# Altium project DBG-010.PrjPcb
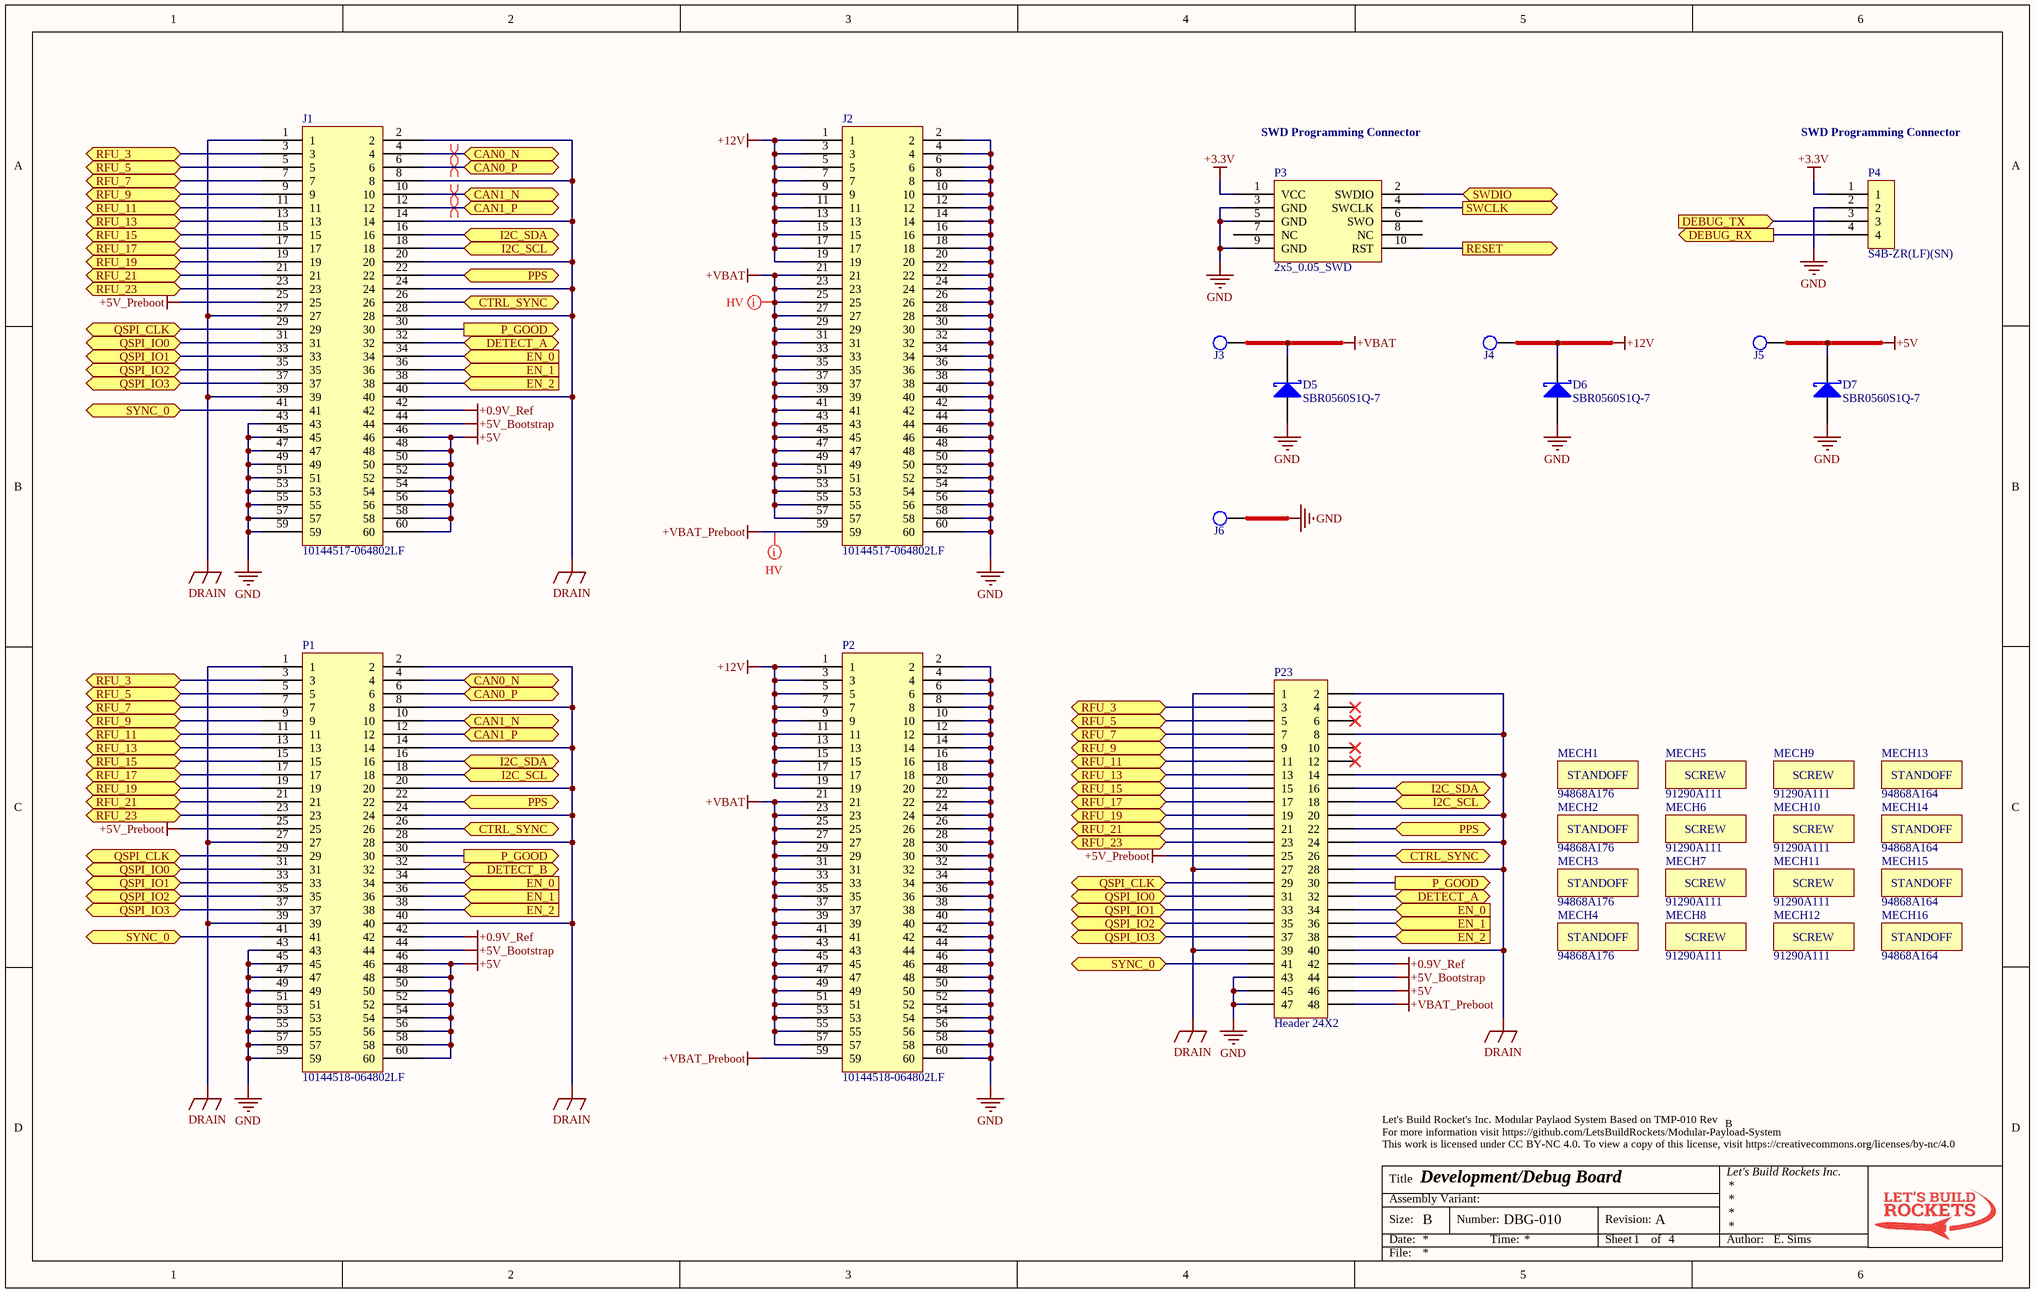
[diagram p0: Sheet1.SchDoc]
ProjectAuthor: E. Sims; ProjectDocumentNumber: DBG-010; ProjectOrganization: Let's Build Rockets Inc.; ProjectRevision: A; ProjectTitle: Development/Debug Board; TemplateRevision: B
4 sheets, 111 parts. Net scope: flat (ports and power ports of the same name join across sheets).
Board file: DBG-010.PcbDoc
Sheets:
  Sheet1.SchDoc
  Sheet2.SchDoc
  Sheet3.SchDoc
  Sheet4.SchDoc

## Sheet Sheet1.SchDoc
size B; SheetNumber: 1; SheetTotal: 4

### Parts
D5  SBR0560S1Q-7  [SOD123]
D6  SBR0560S1Q-7  [SOD123]
D7  SBR0560S1Q-7  [SOD123]
J1  10144517-064802LF  [10144517-064802LF]
J2  10144517-064802LF  [10144517-064802LF]
J3  Banana  [CT3151SP-2]  (value not drawn)
J4  Banana  [CT3151SP-2]  (value not drawn)
J5  Banana  [CT3151SP-2]  (value not drawn)
J6  Banana  [CT3151SP-0]  (value not drawn)
MECH1  94868A176  [94868A176]
MECH2  94868A176  [94868A176]
MECH3  94868A176  [94868A176]
MECH4  94868A176  [94868A176]
MECH5  91290A111  [91290A111]
MECH6  91290A111  [91290A111]
MECH7  91290A111  [91290A111]
MECH8  91290A111  [91290A111]
MECH9  91290A111  [91290A111]
MECH10  91290A111  [91290A111]
MECH11  91290A111  [91290A111]
MECH12  91290A111  [91290A111]
MECH13  94868A164  [94868A164]
MECH14  94868A164  [94868A164]
MECH15  94868A164  [94868A164]
MECH16  94868A164  [94868A164]
P1  10144518-064802LF  [10144518-064802LF]
P2  10144518-064802LF  [10144518-064802LF]
P3  2x5_0.05_SWD  [2x5_0.05_R]
P4  S4B-ZR(LF)(SN)  [S4B-ZR(LF)(SN)]
P23  Header 24X2  [HDR2X24]  (no BOM)

### Ports
CAN0_N (bidir), CAN0_P (bidir), CAN1_N (bidir), CAN1_P (bidir), CTRL_SYNC (bidir), DEBUG_RX (out), DEBUG_TX (in), DETECT_A (bidir), DETECT_B (bidir), EN_0 (in), EN_1 (in), EN_2 (in), I2C_SCL (bidir), I2C_SDA (bidir), P_GOOD (out), PPS (bidir), QSPI_CLK (bidir), QSPI_IO0 (bidir), QSPI_IO1 (bidir), QSPI_IO2 (bidir), QSPI_IO3 (bidir), RESET (out), RFU_3 (bidir), RFU_5 (bidir), RFU_7 (bidir), RFU_9 (bidir), RFU_11 (bidir), RFU_13 (bidir), RFU_15 (bidir), RFU_17 (bidir), RFU_19 (bidir), RFU_21 (bidir), RFU_23 (bidir), SWCLK (out), SWDIO (bidir), SYNC_0 (bidir)

### Nets
+0.9V_Ref: J1.42 P1.42 P23.42
+3.3V: P3.1(VCC) P4.1
+5V: D7.K J1.46 J1.48 J1.50 J1.52 J1.54 J1.56 J1.58 J1.60 J5.1 P1.46 P1.48 P1.50 P1.52 P1.54 P1.56 P1.58 P1.60 P23.46
+5V_Bootstrap: J1.44 P1.44 P23.44
+5V_Preboot: J1.25 P1.25 P23.25
+12V: D6.K J2.1 J2.3 J2.5 J2.7 J2.9 J2.11 J2.13 J2.15 J2.17 J2.19 J4.1 P2.1 P2.3 P2.5 P2.7 P2.9 P2.11 P2.13 P2.15 P2.17 P2.19
+VBAT: D5.K J2.21 J2.23 J2.25 J2.27 J2.29 J2.31 J2.33 J2.35 J2.37 J2.39 J2.41 J2.43 J2.45 J2.47 J2.49 J2.51 J2.53 J2.55 J2.57 J3.1 P2.21 P2.23 P2.25 P2.27 P2.29 P2.31 P2.33 P2.35 P2.37 P2.39 P2.41 P2.43 P2.45 P2.47 P2.49 P2.51 P2.53 P2.55 P2.57
+VBAT_Preboot: J2.59 P2.59 P23.48
DRAIN: J1.1 J1.2 J1.8 J1.14 J1.20 J1.24 J1.27 J1.28 J1.39 J1.40 P1.1 P1.2 P1.8 P1.14 P1.20 P1.24 P1.27 P1.28 P1.39 P1.40 P23.1 P23.2 P23.8 P23.14 P23.20 P23.24 P23.27 P23.28 P23.39 P23.40
GND: D5.A D6.A D7.A J1.43 J1.45 J1.47 J1.49 J1.51 J1.53 J1.55 J1.57 J1.59 J2.2 J2.4 J2.6 J2.8 J2.10 J2.12 J2.14 J2.16 J2.18 J2.20 J2.22 J2.24 J2.26 J2.28 J2.30 J2.32 J2.34 J2.36 J2.38 J2.40 J2.42 J2.44 J2.46 J2.48 J2.50 J2.52 J2.54 J2.56 J2.58 J2.60 J6.1 P1.43 P1.45 P1.47 P1.49 P1.51 P1.53 P1.55 P1.57 P1.59 P2.2 P2.4 P2.6 P2.8 P2.10 P2.12 P2.14 P2.16 P2.18 P2.20 P2.22 P2.24 P2.26 P2.28 P2.30 P2.32 P2.34 P2.36 P2.38 P2.40 P2.42 P2.44 P2.46 P2.48 P2.50 P2.52 P2.54 P2.56 P2.58 P2.60 P3.3(GND) P3.5(GND) P3.9(GND) P4.2 P23.43 P23.45 P23.47
CAN0_N: J1.4 P1.4 ; port CAN0_N
CAN0_P: J1.6 P1.6 ; port CAN0_P
CAN1_N: J1.10 P1.10 ; port CAN1_N
CAN1_P: J1.12 P1.12 ; port CAN1_P
CTRL_SYNC: J1.26 P1.26 P23.26 ; port CTRL_SYNC
DEBUG_RX: P4.4 ; port DEBUG_RX
DEBUG_TX: P4.3 ; port DEBUG_TX
DETECT_A: J1.32 P23.32 ; port DETECT_A
DETECT_B: P1.32 ; port DETECT_B
EN_0: J1.34 P1.34 P23.34 ; port EN_0
EN_1: J1.36 P1.36 P23.36 ; port EN_1
EN_2: J1.38 P1.38 P23.38 ; port EN_2
I2C_SCL: J1.18 P1.18 P23.18 ; port I2C_SCL
I2C_SDA: J1.16 P1.16 P23.16 ; port I2C_SDA
P_GOOD: J1.30 P1.30 P23.30 ; port P_GOOD
PPS: J1.22 P1.22 P23.22 ; port PPS
QSPI_CLK: J1.29 P1.29 P23.29 ; port QSPI_CLK
QSPI_IO0: J1.31 P1.31 P23.31 ; port QSPI_IO0
QSPI_IO1: J1.33 P1.33 P23.33 ; port QSPI_IO1
QSPI_IO2: J1.35 P1.35 P23.35 ; port QSPI_IO2
QSPI_IO3: J1.37 P1.37 P23.37 ; port QSPI_IO3
RESET: P3.10(RST) ; port RESET
RFU_3: J1.3 P1.3 P23.3 ; port RFU_3
RFU_5: J1.5 P1.5 P23.5 ; port RFU_5
RFU_7: J1.7 P1.7 P23.7 ; port RFU_7
RFU_9: J1.9 P1.9 P23.9 ; port RFU_9
RFU_11: J1.11 P1.11 P23.11 ; port RFU_11
RFU_13: J1.13 P1.13 P23.13 ; port RFU_13
RFU_15: J1.15 P1.15 P23.15 ; port RFU_15
RFU_17: J1.17 P1.17 P23.17 ; port RFU_17
RFU_19: J1.19 P1.19 P23.19 ; port RFU_19
RFU_21: J1.21 P1.21 P23.21 ; port RFU_21
RFU_23: J1.23 P1.23 P23.23 ; port RFU_23
SWCLK: P3.4(SWCLK) ; port SWCLK
SWDIO: P3.2(SWDIO) ; port SWDIO
SYNC_0: J1.41 P1.41 P23.41 ; port SYNC_0

Not connected (* = marked no-connect by the designer): P3 6(SWO) 7(NC) 8(NC); P23 4* 6* 10* 12*

### Layout directives
differential pair; differential pair class CAN: CAN0_N, CAN0_P, CAN1_N, CAN1_P
net class HIghVoltage: +VBAT, +VBAT_Preboot

### Notes on the sheet
- SWD Programming Connector
- Let's Build Rocket's Inc. Modular Paylaod System Based on TMP-010 Rev
  For more information visit https://github.com/LetsBuildRockets/Modular-Payload-System
  This work is licensed under CC BY-NC 4.0. To view a copy of this license, visit https://creativecommons.org/licenses/by-nc/4.0
- Title
- Size:
- Date:
- Assembly Variant:
- B
- Number:
- Time:
- Revision:
- Sheet
- of
- Author:
- File:
- (in symbol 91290A111) SCREW
- (in symbol 94868A164) STANDOFF
- (in symbol 94868A176) STANDOFF

### Library data of the parts
D5-D7 = SBR0560S1Q-7: Unit Price (USD): 0.37
J1 J2 = 10144517-064802LF: Unit Price (USD): 1.95
J3-J5 = CT3151SP-2: Unit Price (USD): 2.05
J6 = CT3151SP-0: Unit Price (USD): 2.05
MECH1-MECH4 = 94868A176: Unit Price (USD): 1.32
MECH5-MECH12 = 91290A111: Unit Price (USD): 0.0871
MECH13-MECH16 = 94868A164: Unit Price (USD): 1..10
P1 P2 = 10144518-064802LF: Unit Price (USD): 1.52
P3 = 2x5_0.05_SWD: Unit Price (USD): 0.75
P4 = S4B-ZR(LF)(SN): Unit Price (USD): 0.24
P23 = Header 24X2: Header, 24-Pin, Dual row; LatestRevisionDate: 17-Jul-2002; LatestRevisionNote: Re-released for DXP Platform.; Publisher: Altium Limited

## Sheet Sheet2.SchDoc
size B; SheetNumber: 2; SheetTotal: 4
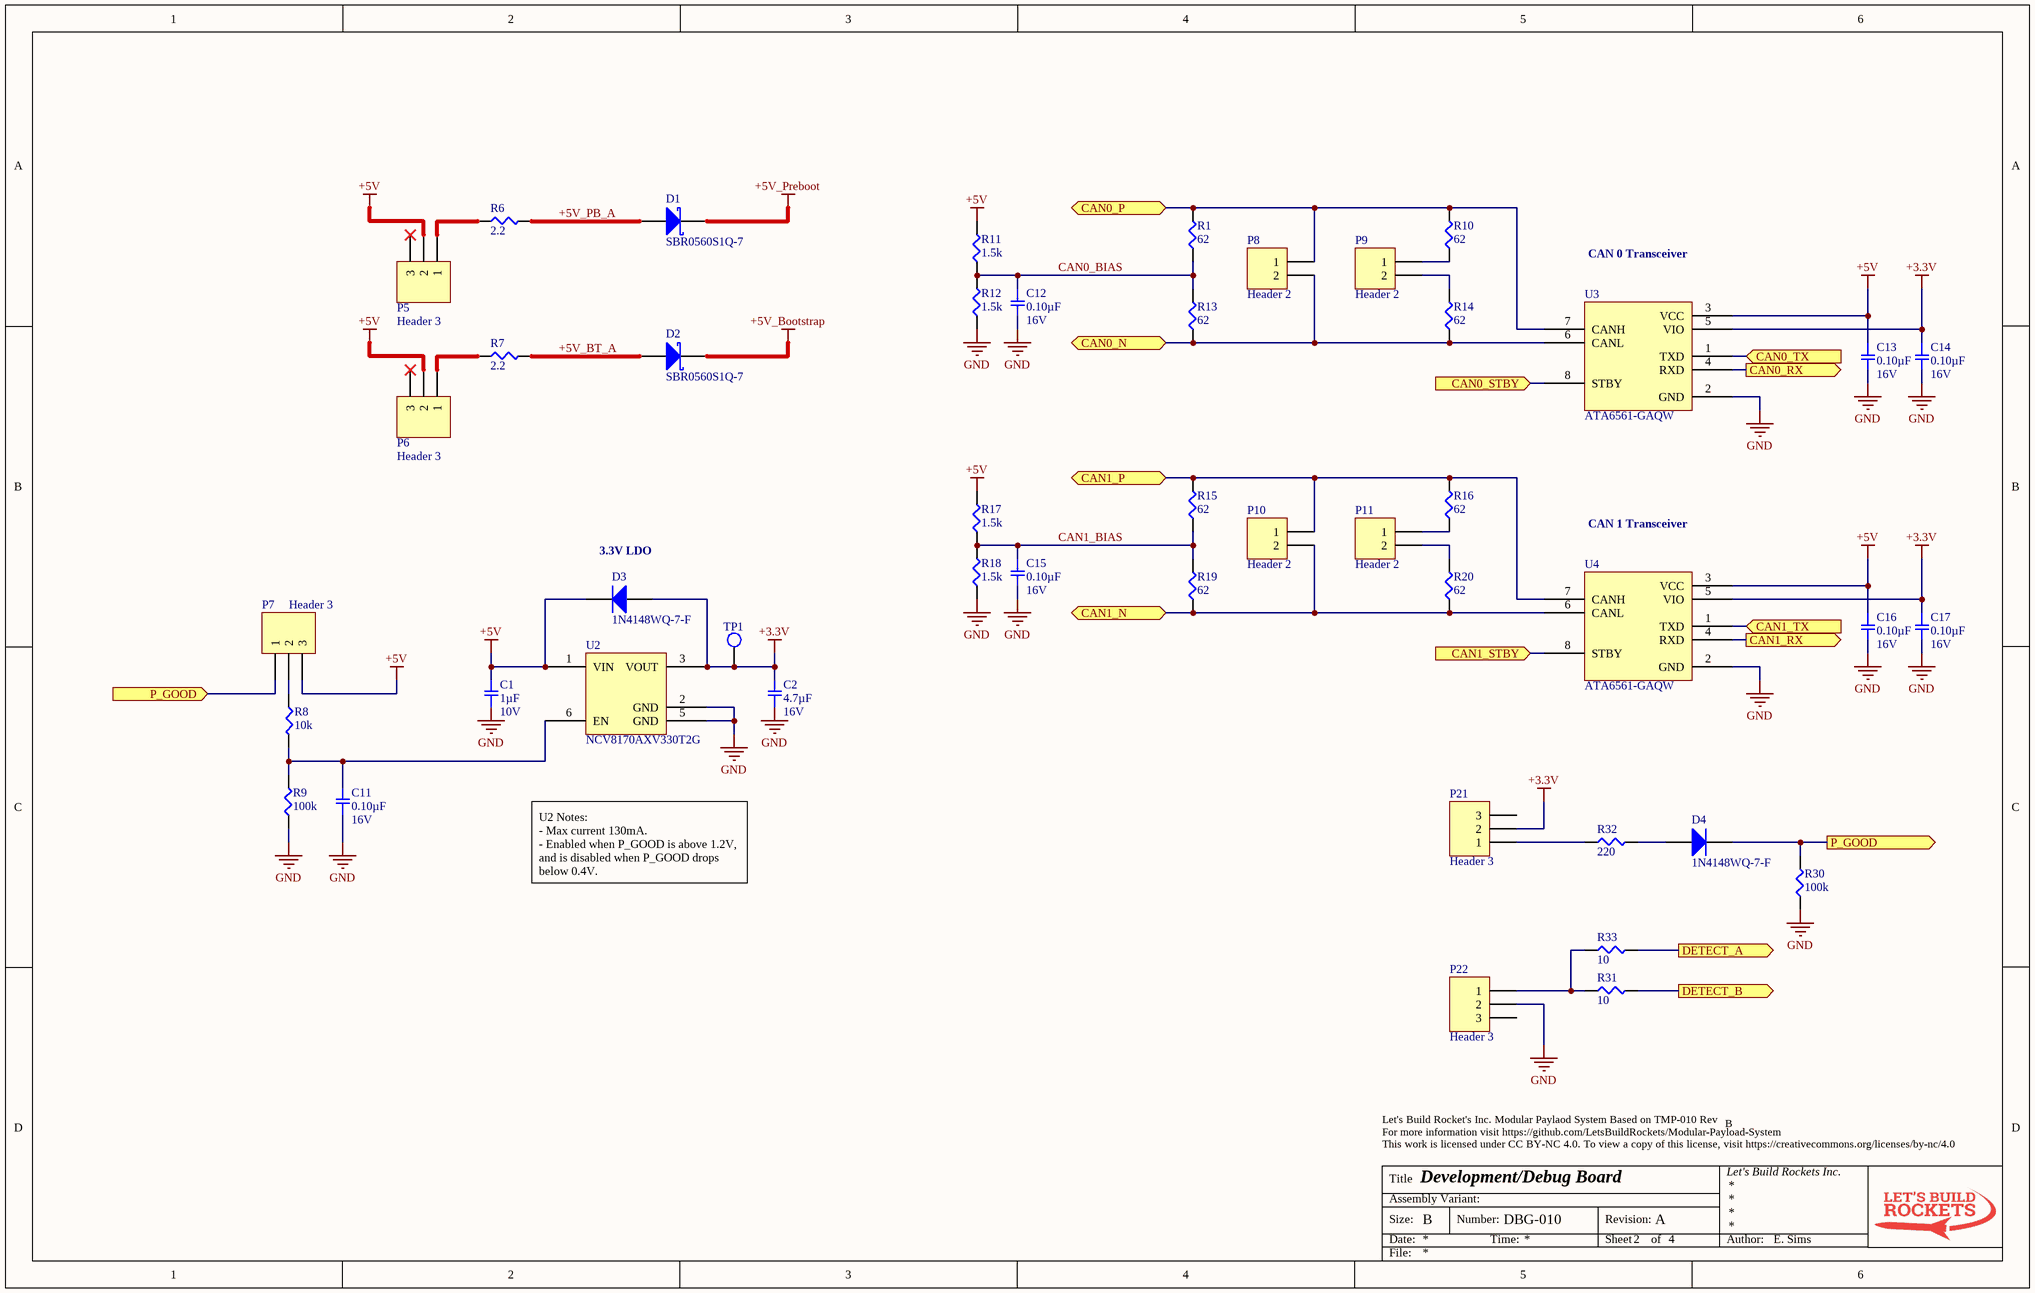
[diagram p1: Sheet2.SchDoc]

### Parts
C1  1µF  Voltage: 10V  [SMD-0402C]
C2  4.7µF  Voltage: 16V  [SMD-0805C]
C11  0.10µF  Voltage: 16V  [SMD-0402C]
C12  0.10µF  Voltage: 16V  [SMD-0402C]
C13  0.10µF  Voltage: 16V  [SMD-0402C]
C14  0.10µF  Voltage: 16V  [SMD-0402C]
C15  0.10µF  Voltage: 16V  [SMD-0402C]
C16  0.10µF  Voltage: 16V  [SMD-0402C]
C17  0.10µF  Voltage: 16V  [SMD-0402C]
D1  SBR0560S1Q-7  [SOD123]
D2  SBR0560S1Q-7  [SOD123]
D3  1N4148WQ-7-F  [SOD123]
D4  1N4148WQ-7-F  [SOD123]
P5  Header 3  [HDR1X3]  (no BOM)
P6  Header 3  [HDR1X3]  (no BOM)
P7  Header 3  [HDR1X3]  (no BOM)
P8  Header 2  [HDR1X2]  (no BOM)
P9  Header 2  [HDR1X2]  (no BOM)
P10  Header 2  [HDR1X2]  (no BOM)
P11  Header 2  [HDR1X2]  (no BOM)
P21  Header 3  [HDR1X3]  (no BOM)
P22  Header 3  [HDR1X3]  (no BOM)
R1  62  [SMD-0603-RES]
R6  2.2  [SMD-0805-RES]
R7  2.2  [SMD-0805-RES]
R8  10k  [SMD-0402-RES]
R9  100k  [SMD-0402-RES]
R10  62  [SMD-0603-RES]
R11  1.5k  [SMD-0402-RES]
R12  1.5k  [SMD-0402-RES]
R13  62  [SMD-0603-RES]
R14  62  [SMD-0603-RES]
R15  62  [SMD-0603-RES]
R16  62  [SMD-0603-RES]
R17  1.5k  [SMD-0402-RES]
R18  1.5k  [SMD-0402-RES]
R19  62  [SMD-0603-RES]
R20  62  [SMD-0603-RES]
R30  100k  [SMD-0402-RES]
R31  10  [SMD-0402-RES]
R32  220  [SMD-0402-RES]
R33  10  [SMD-0402-RES]
TP1  TP  [TP_SMD_40]  (value not drawn)  (no BOM)
U2  NCV8170AXV330T2G  [SOTFL50P160X60-6N]
U3  ATA6561-GAQW  [SOIC127P600X175-8N]
U4  ATA6561-GAQW  [SOIC127P600X175-8N]

### Ports
CAN0_N (bidir), CAN0_P (bidir), CAN0_RX (out), CAN0_STBY (in), CAN0_TX (in), CAN1_N (bidir), CAN1_P (bidir), CAN1_RX (out), CAN1_STBY (in), CAN1_TX (in), DETECT_A (out), DETECT_B (out), P_GOOD (in), P_GOOD (out)

### Nets
+3.3V: C2.2 C14.1 C17.1 D3.A P21.2 TP1.1 U2.3(VOUT) U3.5(VIO) U4.5(VIO)
+5V: C1.2 C13.1 C16.1 D3.K P5.2 P6.2 P7.3 R11.2 R17.2 U2.1(VIN) U3.3(VCC) U4.3(VCC)
+5V_Bootstrap: D2.K
+5V_Preboot: D1.K
GND: C1.1 C2.1 C11.1 C12.2 C13.2 C14.2 C15.2 C16.2 C17.2 P22.2 R9.1 R12.1 R18.1 R30.1 U2.2(GND) U2.5(GND) U3.2(GND) U4.2(GND)
+5V_BT_A: D2.A R7.2
+5V_PB_A: D1.A R6.2
CAN0_BIAS: C12.1 R1.1 R11.1 R12.2 R13.2
CAN0_N: P8.2 R13.1 R14.1 U3.6(CANL) ; port CAN0_N
CAN0_P: P8.1 R1.2 R10.2 U3.7(CANH) ; port CAN0_P
CAN0_RX: U3.4(RXD) ; port CAN0_RX
CAN0_STBY: U3.8(STBY) ; port CAN0_STBY
CAN0_TX: U3.1(TXD) ; port CAN0_TX
CAN1_BIAS: C15.1 R15.1 R17.1 R18.2 R19.2
CAN1_N: P10.2 R19.1 R20.1 U4.6(CANL) ; port CAN1_N
CAN1_P: P10.1 R15.2 R16.2 U4.7(CANH) ; port CAN1_P
CAN1_RX: U4.4(RXD) ; port CAN1_RX
CAN1_STBY: U4.8(STBY) ; port CAN1_STBY
CAN1_TX: U4.1(TXD) ; port CAN1_TX
DETECT_A: R33.2 ; port DETECT_A
DETECT_B: R31.2 ; port DETECT_B
P_GOOD: D4.K P7.1 R30.2 ; port P_GOOD
NetC11_2: C11.2 R8.2 R9.2 U2.6(EN)
NetD4_A: D4.A R32.2
NetP5_1: P5.1 R6.1
NetP6_1: P6.1 R7.1
NetP7_2: P7.2 R8.1
NetP9_1: P9.1 R10.1
NetP9_2: P9.2 R14.2
NetP11_1: P11.1 R16.1
NetP11_2: P11.2 R20.2
NetP21_1: P21.1 R32.1
NetP22_1: P22.1 R31.1 R33.1

Not connected (* = marked no-connect by the designer): P5 3*; P6 3*; P21 3; P22 3

### Notes on the sheet
- CAN 0 Transceiver
- (near D3) 3.3V LDO
- CAN 1 Transceiver
- U2 Notes:
  - Max current 130mA.
  - Enabled when P_GOOD is above 1.2V, and is disabled when P_GOOD drops below 0.4V.
- Let's Build Rocket's Inc. Modular Paylaod System Based on TMP-010 Rev
  For more information visit https://github.com/LetsBuildRockets/Modular-Payload-System
  This work is licensed under CC BY-NC 4.0. To view a copy of this license, visit https://creativecommons.org/licenses/by-nc/4.0
- Title
- Size:
- Date:
- Assembly Variant:
- B
- Number:
- Time:
- Revision:
- Sheet
- of
- Author:
- File:

### Library data of the parts
C1 = GCM155C71A105KE38D: CAP CER 1UF 10V X7S 0402; Manufacturer: Murata Electronics North America; Factory Stock: 0; Unit Price (USD): 0.12; Minimum Quantity: 1; Tolerance: ±10%; Datasheets: http://www.murata.com/~/media/webrenewal/support/library/catalog/products/capacitor/mlcc/c03e.ashx; Image: //media.digikey.com/Renders/Murata%20Renders/ZRB-SERIES-0402.jpg; Digi-Key Part Number: 490-13409-1-ND; Part Number: GCM155C71A105KE38D; Quantity Available: 7240; @ qty: 0; Packaging: Cut Tape (CT); Series: GCM; Part Status: Active; Value: 1µF; Temperature Coefficient: X7S; Operating Temperature: -55°C ~ 125°C; Features: -; Ratings: AEC-Q200; Applications: Automotive; Mounting Type: Surface Mount, MLCC; Package / Case: 0402 (1005 Metric); Size / Dimension: 0.039" L x 0.020" W (1.00mm x 0.50mm); Height - Seated (Max): -; Thickness (Max): 0.022" (0.55mm); Lead Spacing: -; Lead Style: -
C2 = GCJ21BR71C475KA01L: CAP CER 4.7UF 16V X7R 0805; Manufacturer: Murata Electronics North America; Factory Stock: 0; Unit Price (USD): 0.44; Minimum Quantity: 1; Tolerance: ±10%; Datasheets: http://www.murata.com/~/media/webrenewal/support/library/catalog/products/capacitor/mlcc/c03e.ashx; Image: //media.digikey.com/Renders/Murata%20Renders/0805%20(2012%20Metric)%20.85mm.jpg; Digi-Key Part Number: 490-10557-1-ND; Part Number: GCJ21BR71C475KA01L; Quantity Available: 53217; @ qty: 0; Packaging: Cut Tape (CT); Series: GCJ; Part Status: Active; Value: 4.7µF; Temperature Coefficient: X7R; Operating Temperature: -55°C ~ 125°C; Features: Soft Termination; Ratings: AEC-Q200; Applications: Automotive, Boardflex Sensitive; Mounting Type: Surface Mount, MLCC; Package / Case: 0805 (2012 Metric); Size / Dimension: 0.079" L x 0.049" W (2.00mm x 1.25mm); Height - Seated (Max): -; Thickness (Max): 0.057" (1.45mm); Lead Spacing: -; Lead Style: -
C11-C17 = GCM155R71C104KA55D: CAP CER 0.1UF 16V X7R 0402; Manufacturer: Murata Electronics North America; Factory Stock: 0; Unit Price (USD): 0.1; Minimum Quantity: 1; Tolerance: ±10%; Datasheets: http://www.murata.com/~/media/webrenewal/support/library/catalog/products/capacitor/mlcc/c03e.ashx; Image: //media.digikey.com/Renders/Murata%20Renders/ZRB-SERIES-0402.jpg; Digi-Key Part Number: 490-4759-1-ND; Part Number: GCM155R71C104KA55D; Quantity Available: 734194; @ qty: 0; Packaging: Cut Tape (CT); Series: GCM; Part Status: Active; Value: 0.10µF; Temperature Coefficient: X7R; Operating Temperature: -55°C ~ 125°C; Features: -; Ratings: AEC-Q200; Applications: Automotive; Mounting Type: Surface Mount, MLCC; Package / Case: 0402 (1005 Metric); Size / Dimension: 0.039" L x 0.020" W (1.00mm x 0.50mm); Height - Seated (Max): -; Thickness (Max): 0.022" (0.55mm); Lead Spacing: -; Lead Style: -
D1 D2 = SBR0560S1Q-7: Unit Price (USD): 0.37
D3 D4 = 1N4148WQ-7-F: Unit Price (USD): 0.19
P5-P7 P21 P22 = Header 3: Header, 3-Pin; LatestRevisionDate: 17-Jul-2002; LatestRevisionNote: Re-released for DXP Platform.; Publisher: Altium Limited
P8-P11 = Header 2: Header, 2-Pin; LatestRevisionDate: 17-Jul-2002; LatestRevisionNote: Re-released for DXP Platform.; Publisher: Altium Limited
R1 R10 R13-R16 R19 R20 = ERJ-PA3J620V: RES SMD 62 OHM 5% 1/4W 0603; Manufacturer: Panasonic Electronic Components; Factory Stock: 0; Unit Price (USD): 0.01646; @ qty: 1500; Minimum Quantity: 1; Power (Watts): 0.25W, 1/4W; Temperature Coefficient: ±200ppm/°C; Part Number: ERJ-PA3J620V; Datasheets: https://industrial.panasonic.com/cdbs/www-data/pdf/RDA0000/AOA0000C243.pdf; Image: //media.digikey.com/Photos/Panasonic%20Photos/MFG_ERJ-P6W%20Series.jpg; Digi-Key Part Number: P62.00BZCT-ND; Quantity Available: 2726; Packaging: Cut Tape (CT); Series: ERJ; Part Status: Active; Value: 62; Tolerance: ±5%; Composition: Thick Film; Features: Automotive AEC-Q200, Pulse Withstanding; Operating Temperature: -55°C ~ 155°C; Package / Case: 0603 (1608 Metric); Supplier Device Package: 0603; Size / Dimension: 0.063" L x 0.031" W (1.60mm x 0.80mm); Height - Seated (Max): 0.022" (0.55mm); Number of Terminations: 2; Failure Rate: -
R6 R7 = ERJ-6GEYJ2R2V: RES SMD 2.2 OHM 5% 1/8W 0805; Manufacturer: Panasonic Electronic Components; Factory Stock: 0; Unit Price (USD): 0.00496; @ qty: 1500; Minimum Quantity: 1; Power (Watts): 0.125W, 1/8W; Temperature Coefficient: -100/ +600ppm/°C; Part Number: ERJ-6GEYJ2R2V; Datasheets: http://industrial.panasonic.com/www-cgi/jvcr13pz.cgi?E+PZ+3+AOA0001+ERJ6GEYJ2R2V+7+WW; Image: //media.digikey.com/Renders/Panasonic%20Renders/ERJ-0805%20Pkg.jpg; Digi-Key Part Number: P2.2ACT-ND; Quantity Available: 74294; Packaging: Cut Tape (CT); Series: ERJ; Part Status: Active; Value: 2.2; Tolerance: ±5%; Composition: Thick Film; Features: Automotive AEC-Q200; Operating Temperature: -55°C ~ 155°C; Package / Case: 0805 (2012 Metric); Supplier Device Package: 0805; Size / Dimension: 0.079" L x 0.049" W (2.00mm x 1.25mm); Height - Seated (Max): 0.028" (0.70mm); Number of Terminations: 2; Failure Rate: -
R8 = ERJ-2GEJ103X: RES SMD 10K OHM 5% 1/10W 0402; Manufacturer: Panasonic Electronic Components; Factory Stock: 0; Unit Price (USD): 0.00350; @ qty: 1500; Minimum Quantity: 1; Power (Watts): 0.1W, 1/10W; Temperature Coefficient: ±200ppm/°C; Part Number: ERJ-2GEJ103X; Datasheets: http://industrial.panasonic.com/www-cgi/jvcr13pz.cgi?E+PZ+3+AOA0001+ERJ2GEJ103X+7+WW; Image: //media.digikey.com/Photos/Panasonic%20Photos/ERJ-PA2-Series.jpg; Digi-Key Part Number: P10KJCT-ND; Quantity Available: 2560215; Packaging: Cut Tape (CT); Series: ERJ; Part Status: Active; Value: 10k; Tolerance: ±5%; Composition: Thick Film; Features: Automotive AEC-Q200; Operating Temperature: -55°C ~ 155°C; Package / Case: 0402 (1005 Metric); Supplier Device Package: 0402; Size / Dimension: 0.039" L x 0.020" W (1.00mm x 0.50mm); Height - Seated (Max): 0.016" (0.40mm); Number of Terminations: 2; Failure Rate: -
R9 R30 = ERJ-2GEJ104X: RES SMD 100K OHM 5% 1/10W 0402; Manufacturer: Panasonic Electronic Components; Factory Stock: 0; Unit Price (USD): 0.00350; @ qty: 1500; Minimum Quantity: 1; Power (Watts): 0.1W, 1/10W; Temperature Coefficient: ±200ppm/°C; Part Number: ERJ-2GEJ104X; Datasheets: http://industrial.panasonic.com/www-cgi/jvcr13pz.cgi?E+PZ+3+AOA0001+ERJ2GEJ104X+7+WW; Image: //media.digikey.com/Photos/Panasonic%20Photos/ERJ-PA2-Series.jpg; Digi-Key Part Number: P100KJCT-ND; Quantity Available: 2387986; Packaging: Cut Tape (CT); Series: ERJ; Part Status: Active; Value: 100k; Tolerance: ±5%; Composition: Thick Film; Features: Automotive AEC-Q200; Operating Temperature: -55°C ~ 155°C; Package / Case: 0402 (1005 Metric); Supplier Device Package: 0402; Size / Dimension: 0.039" L x 0.020" W (1.00mm x 0.50mm); Height - Seated (Max): 0.016" (0.40mm); Number of Terminations: 2; Failure Rate: -
R11 R12 R17 R18 = ERJ-2RKF1501X: RES SMD 1.5K OHM 1% 1/10W 0402; Manufacturer: Panasonic Electronic Components; Factory Stock: 0; Unit Price (USD): 0.00496; @ qty: 1500; Minimum Quantity: 1; Power (Watts): 0.1W, 1/10W; Temperature Coefficient: ±100ppm/°C; Part Number: ERJ-2RKF1501X; Datasheets: http://industrial.panasonic.com/www-cgi/jvcr13pz.cgi?E+PZ+3+AOA0002+ERJ2RKF1501X+7+WW; Image: //media.digikey.com/Photos/Panasonic%20Photos/ERJ-PA2-Series.jpg; Digi-Key Part Number: P1.50KLCT-ND; Quantity Available: 462851; Packaging: Cut Tape (CT); Series: ERJ; Part Status: Active; Value: 1.5k; Tolerance: ±1%; Composition: Thick Film; Features: Automotive AEC-Q200; Operating Temperature: -55°C ~ 155°C; Package / Case: 0402 (1005 Metric); Supplier Device Package: 0402; Size / Dimension: 0.039" L x 0.020" W (1.00mm x 0.50mm); Height - Seated (Max): 0.016" (0.40mm); Number of Terminations: 2; Failure Rate: -
R31 R33 = ERJ-2GEJ100X: RES SMD 10 OHM 5% 1/10W 0402; Manufacturer: Panasonic Electronic Components; Factory Stock: 0; Unit Price (USD): 0.00350; @ qty: 1500; Minimum Quantity: 1; Power (Watts): 0.1W, 1/10W; Temperature Coefficient: ±200ppm/°C; Part Number: ERJ-2GEJ100X; Datasheets: http://industrial.panasonic.com/www-cgi/jvcr13pz.cgi?E+PZ+3+AOA0001+ERJ2GEJ100X+7+WW; Image: //media.digikey.com/Photos/Panasonic%20Photos/ERJ-PA2-Series.jpg; Digi-Key Part Number: P10JCT-ND; Quantity Available: 1054751; Packaging: Cut Tape (CT); Series: ERJ; Part Status: Active; Value: 10; Tolerance: ±5%; Composition: Thick Film; Features: Automotive AEC-Q200; Operating Temperature: -55°C ~ 155°C; Package / Case: 0402 (1005 Metric); Supplier Device Package: 0402; Size / Dimension: 0.039" L x 0.020" W (1.00mm x 0.50mm); Height - Seated (Max): 0.016" (0.40mm); Number of Terminations: 2; Failure Rate: -
R32 = ERJ-2GEJ221X: RES SMD 220 OHM 5% 1/10W 0402; Manufacturer: Panasonic Electronic Components; Factory Stock: 0; Unit Price (USD): 0.00350; @ qty: 1500; Minimum Quantity: 1; Power (Watts): 0.1W, 1/10W; Temperature Coefficient: ±200ppm/°C; Part Number: ERJ-2GEJ221X; Datasheets: http://industrial.panasonic.com/www-cgi/jvcr13pz.cgi?E+PZ+3+AOA0001+ERJ2GEJ221X+7+WW; Image: //media.digikey.com/Photos/Panasonic%20Photos/ERJ-PA2-Series.jpg; Digi-Key Part Number: P220JCT-ND; Quantity Available: 702646; Packaging: Cut Tape (CT); Series: ERJ; Part Status: Active; Value: 220; Tolerance: ±5%; Composition: Thick Film; Features: Automotive AEC-Q200; Operating Temperature: -55°C ~ 155°C; Package / Case: 0402 (1005 Metric); Supplier Device Package: 0402; Size / Dimension: 0.039" L x 0.020" W (1.00mm x 0.50mm); Height - Seated (Max): 0.016" (0.40mm); Number of Terminations: 2; Failure Rate: -
U2 = NCV8170AXV330T2G: Unit Price (USD): 0.44
U3 U4 = ATA6561-GAQW: Unit Price (USD): 0.53

## Sheet Sheet3.SchDoc
size B; SheetNumber: 3; SheetTotal: 4
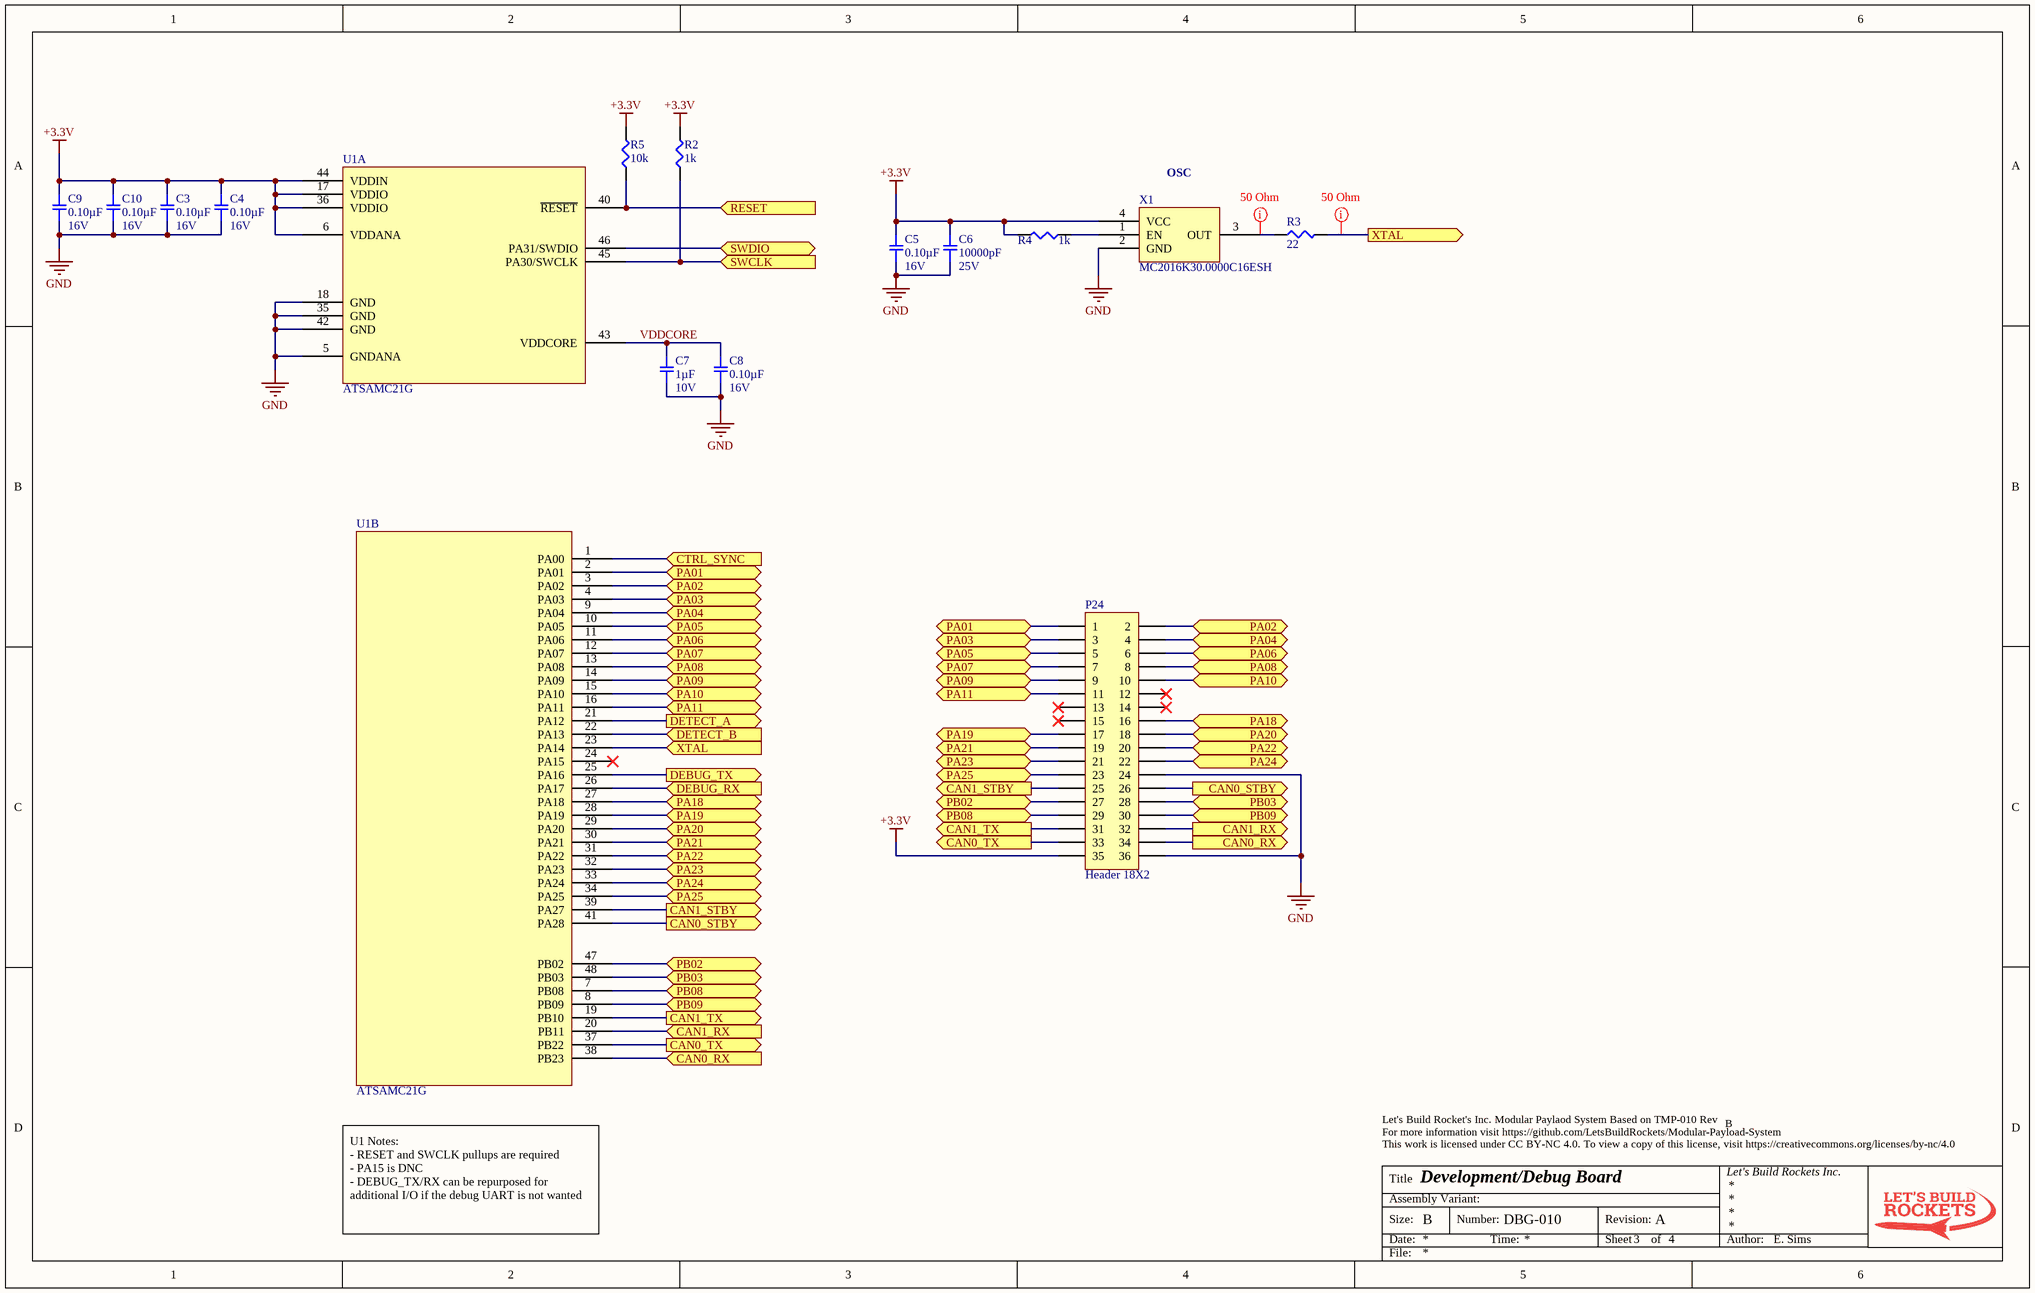
[diagram p2: Sheet3.SchDoc]

### Parts
C3  0.10µF  Voltage: 16V  [SMD-0402C]
C4  0.10µF  Voltage: 16V  [SMD-0402C]
C5  0.10µF  Voltage: 16V  [SMD-0402C]
C6  10000pF  Voltage: 25V  [SMD-0402C]
C7  1µF  Voltage: 10V  [SMD-0402C]
C8  0.10µF  Voltage: 16V  [SMD-0402C]
C9  0.10µF  Voltage: 16V  [SMD-0402C]
C10  0.10µF  Voltage: 16V  [SMD-0402C]
P24  Header 18X2  [HDR2X18]  (no BOM)
R2  1k  [SMD-0402-RES]
R3  22  [SMD-0402-RES]
R4  1k  [SMD-0402-RES]
R5  10k  [SMD-0402-RES]
U1  ATSAMC21G  [TSQFP50P900X900X120-48N]  (parts A,B of 2)
X1  MC2016K30.0000C16ESH  [MC2016]

### Ports
CAN0_RX (in), CAN0_RX (out), CAN0_STBY (out), CAN0_TX (out), CAN1_RX (in), CAN1_RX (out), CAN1_STBY (out), CAN1_TX (out), CTRL_SYNC (in), DEBUG_RX (in), DEBUG_TX (out), DETECT_A (out), DETECT_B (in), PA01 (bidir), PA02 (bidir), PA03 (bidir), PA04 (bidir), PA05 (bidir), PA06 (bidir), PA07 (bidir), PA08 (bidir), PA09 (bidir), PA10 (bidir), PA11 (bidir), PA18 (bidir), PA19 (bidir), PA20 (bidir), PA21 (bidir), PA22 (bidir), PA23 (bidir), PA24 (bidir), PA25 (bidir), PB02 (bidir), PB03 (bidir), PB08 (bidir), PB09 (bidir), RESET (in), SWCLK (in), SWDIO (bidir), XTAL (in), XTAL (out)

### Nets
+3.3V: C3.2 C4.2 C5.2 C6.2 C9.2 C10.2 P24.35 R2.2 R4.2 R5.2 U1.6(VDDANA) U1.17(VDDIO) U1.36(VDDIO) U1.44(VDDIN) X1.4(VCC)
GND: C3.1 C4.1 C5.1 C6.1 C7.1 C8.1 C9.1 C10.1 P24.24 P24.36 U1.5(GNDANA) U1.18(GND) U1.35(GND) U1.42(GND) X1.2(GND)
CAN0_RX: P24.34 U1.38(PB23) ; port CAN0_RX
CAN0_STBY: P24.26 U1.41(PA28) ; port CAN0_STBY
CAN0_TX: P24.33 U1.37(PB22) ; port CAN0_TX
CAN1_RX: P24.32 U1.20(PB11) ; port CAN1_RX
CAN1_STBY: P24.25 U1.39(PA27) ; port CAN1_STBY
CAN1_TX: P24.31 U1.19(PB10) ; port CAN1_TX
CTRL_SYNC: U1.1(PA00) ; port CTRL_SYNC
DEBUG_RX: U1.26(PA17) ; port DEBUG_RX
DEBUG_TX: U1.25(PA16) ; port DEBUG_TX
DETECT_A: U1.21(PA12) ; port DETECT_A
DETECT_B: U1.22(PA13) ; port DETECT_B
PA01: P24.1 U1.2(PA01) ; port PA01
PA02: P24.2 U1.3(PA02) ; port PA02
PA03: P24.3 U1.4(PA03) ; port PA03
PA04: P24.4 U1.9(PA04) ; port PA04
PA05: P24.5 U1.10(PA05) ; port PA05
PA06: P24.6 U1.11(PA06) ; port PA06
PA07: P24.7 U1.12(PA07) ; port PA07
PA08: P24.8 U1.13(PA08) ; port PA08
PA09: P24.9 U1.14(PA09) ; port PA09
PA10: P24.10 U1.15(PA10) ; port PA10
PA11: P24.11 U1.16(PA11) ; port PA11
PA18: P24.16 U1.27(PA18) ; port PA18
PA19: P24.17 U1.28(PA19) ; port PA19
PA20: P24.18 U1.29(PA20) ; port PA20
PA21: P24.19 U1.30(PA21) ; port PA21
PA22: P24.20 U1.31(PA22) ; port PA22
PA23: P24.21 U1.32(PA23) ; port PA23
PA24: P24.22 U1.33(PA24) ; port PA24
PA25: P24.23 U1.34(PA25) ; port PA25
PB02: P24.27 U1.47(PB02) ; port PB02
PB03: P24.28 U1.48(PB03) ; port PB03
PB08: P24.29 U1.7(PB08) ; port PB08
PB09: P24.30 U1.8(PB09) ; port PB09
RESET: R5.1 U1.40(~{RESET}) ; port RESET
SWCLK: R2.1 U1.45(PA30/SWCLK) ; port SWCLK
SWDIO: U1.46(PA31/SWDIO) ; port SWDIO
VDDCORE: C7.2 C8.2 U1.43(VDDCORE)
XTAL: R3.2 U1.23(PA14) ; port XTAL
NetR3_1: R3.1 X1.3(OUT)
NetR4_1: R4.1 X1.1(EN)

Not connected (* = marked no-connect by the designer): P24 12* 13* 14* 15*; U1 24(PA15)*

### Layout directives
rule Width Constraint [Pref Impedance = 50.00ohms    Min Impedance = 50.00ohms    Max Impedance = 50.00ohms]: NetR3_1, XTAL

### Notes on the sheet
- (near X1) OSC
- U1 Notes:
  - RESET and SWCLK pullups are required
  - PA15 is DNC
  - DEBUG_TX/RX can be repurposed for additional I/O if the debug UART is not wanted
- Let's Build Rocket's Inc. Modular Paylaod System Based on TMP-010 Rev
  For more information visit https://github.com/LetsBuildRockets/Modular-Payload-System
  This work is licensed under CC BY-NC 4.0. To view a copy of this license, visit https://creativecommons.org/licenses/by-nc/4.0
- Title
- Size:
- Date:
- Assembly Variant:
- B
- Number:
- Time:
- Revision:
- Sheet
- of
- Author:
- File:

### Library data of the parts
C3-C5 C8-C10 = GCM155R71C104KA55D: as C11 on sheet Sheet2; Datasheets: http://www.murata.com/~/media/webrenewal/support/library/catalog/products/capacitor/mlcc/c03e.ashx; Image: //media.digikey.com/Renders/Murata%20Renders/ZRB-SERIES-0402.jpg; Digi-Key Part Number: 490-4759-1-ND; Part Number: GCM155R71C104KA55D; Quantity Available: 734194; @ qty: 0; Packaging: Cut Tape (CT); Series: GCM; Part Status: Active; Value: 0.10µF; Temperature Coefficient: X7R; Operating Temperature: -55°C ~ 125°C; Features: -; Ratings: AEC-Q200; Applications: Automotive; Mounting Type: Surface Mount, MLCC; Package / Case: 0402 (1005 Metric); Size / Dimension: 0.039" L x 0.020" W (1.00mm x 0.50mm); Height - Seated (Max): -; Thickness (Max): 0.022" (0.55mm); Lead Spacing: -; Lead Style: -
C6 = GCM155R71E103KA37D: CAP CER 10000PF 25V X7R 0402; Manufacturer: Murata Electronics North America; Factory Stock: 0; Unit Price (USD): 0.1; Minimum Quantity: 1; Tolerance: ±10%; Datasheets: http://www.murata.com/~/media/webrenewal/support/library/catalog/products/capacitor/mlcc/c03e.ashx; Image: //media.digikey.com/Renders/Murata%20Renders/ZRB-SERIES-0402.jpg; Digi-Key Part Number: 490-6043-1-ND; Part Number: GCM155R71E103KA37D; Quantity Available: 128782; @ qty: 0; Packaging: Cut Tape (CT); Series: GCM; Part Status: Active; Value: 10000pF; Temperature Coefficient: X7R; Operating Temperature: -55°C ~ 125°C; Features: -; Ratings: AEC-Q200; Applications: Automotive; Mounting Type: Surface Mount, MLCC; Package / Case: 0402 (1005 Metric); Size / Dimension: 0.039" L x 0.020" W (1.00mm x 0.50mm); Height - Seated (Max): -; Thickness (Max): 0.022" (0.55mm); Lead Spacing: -; Lead Style: -
C7 = GCM155C71A105KE38D: as C1 on sheet Sheet2; Datasheets: http://www.murata.com/~/media/webrenewal/support/library/catalog/products/capacitor/mlcc/c03e.ashx; Image: //media.digikey.com/Renders/Murata%20Renders/ZRB-SERIES-0402.jpg; Digi-Key Part Number: 490-13409-1-ND; Part Number: GCM155C71A105KE38D; Quantity Available: 7240; @ qty: 0; Packaging: Cut Tape (CT); Series: GCM; Part Status: Active; Value: 1µF; Temperature Coefficient: X7S; Operating Temperature: -55°C ~ 125°C; Features: -; Ratings: AEC-Q200; Applications: Automotive; Mounting Type: Surface Mount, MLCC; Package / Case: 0402 (1005 Metric); Size / Dimension: 0.039" L x 0.020" W (1.00mm x 0.50mm); Height - Seated (Max): -; Thickness (Max): 0.022" (0.55mm); Lead Spacing: -; Lead Style: -
P24 = Header 18X2: Header, 18-Pin, Dual row; LatestRevisionDate: 17-Jul-2002; LatestRevisionNote: Re-released for DXP Platform.; Publisher: Altium Limited
R2 R4 = ERJ-2GEJ102X: RES SMD 1K OHM 5% 1/10W 0402; Manufacturer: Panasonic Electronic Components; Factory Stock: 0; Unit Price (USD): 0.00350; @ qty: 1500; Minimum Quantity: 1; Power (Watts): 0.1W, 1/10W; Temperature Coefficient: ±200ppm/°C; Part Number: ERJ-2GEJ102X; Datasheets: http://industrial.panasonic.com/www-cgi/jvcr13pz.cgi?E+PZ+3+AOA0001+ERJ2GEJ102X+7+WW; Image: //media.digikey.com/Photos/Panasonic%20Photos/ERJ-PA2-Series.jpg; Digi-Key Part Number: P1.0KJCT-ND; Quantity Available: 1939857; Packaging: Cut Tape (CT); Series: ERJ; Part Status: Active; Value: 1k; Tolerance: ±5%; Composition: Thick Film; Features: Automotive AEC-Q200; Operating Temperature: -55°C ~ 155°C; Package / Case: 0402 (1005 Metric); Supplier Device Package: 0402; Size / Dimension: 0.039" L x 0.020" W (1.00mm x 0.50mm); Height - Seated (Max): 0.016" (0.40mm); Number of Terminations: 2; Failure Rate: -
R3 = ERJ-2RKF22R0X: RES SMD 22 OHM 1% 1/10W 0402; Manufacturer: Panasonic Electronic Components; Factory Stock: 0; Unit Price (USD): 0.00496; @ qty: 1500; Minimum Quantity: 1; Power (Watts): 0.1W, 1/10W; Temperature Coefficient: ±100ppm/°C; Part Number: ERJ-2RKF22R0X; Datasheets: http://industrial.panasonic.com/www-cgi/jvcr13pz.cgi?E+PZ+3+AOA0002+ERJ2RKF22R0X+7+WW; Image: //media.digikey.com/Photos/Panasonic%20Photos/ERJ-PA2-Series.jpg; Digi-Key Part Number: P22.0LCT-ND; Quantity Available: 620432; Packaging: Cut Tape (CT); Series: ERJ; Part Status: Active; Value: 22; Tolerance: ±1%; Composition: Thick Film; Features: Automotive AEC-Q200; Operating Temperature: -55°C ~ 155°C; Package / Case: 0402 (1005 Metric); Supplier Device Package: 0402; Size / Dimension: 0.039" L x 0.020" W (1.00mm x 0.50mm); Height - Seated (Max): 0.016" (0.40mm); Number of Terminations: 2; Failure Rate: -
R5 = ERJ-2GEJ103X: as R8 on sheet Sheet2; Part Number: ERJ-2GEJ103X; Datasheets: http://industrial.panasonic.com/www-cgi/jvcr13pz.cgi?E+PZ+3+AOA0001+ERJ2GEJ103X+7+WW; Image: //media.digikey.com/Photos/Panasonic%20Photos/ERJ-PA2-Series.jpg; Digi-Key Part Number: P10KJCT-ND; Quantity Available: 2560215; Packaging: Cut Tape (CT); Series: ERJ; Part Status: Active; Value: 10k; Tolerance: ±5%; Composition: Thick Film; Features: Automotive AEC-Q200; Operating Temperature: -55°C ~ 155°C; Package / Case: 0402 (1005 Metric); Supplier Device Package: 0402; Size / Dimension: 0.039" L x 0.020" W (1.00mm x 0.50mm); Height - Seated (Max): 0.016" (0.40mm); Number of Terminations: 2; Failure Rate: -
X1 = MC2016K30.0000C16ESH: Unit Price (USD): 2.37

## Sheet Sheet4.SchDoc
size B; SheetNumber: 4; SheetTotal: 4
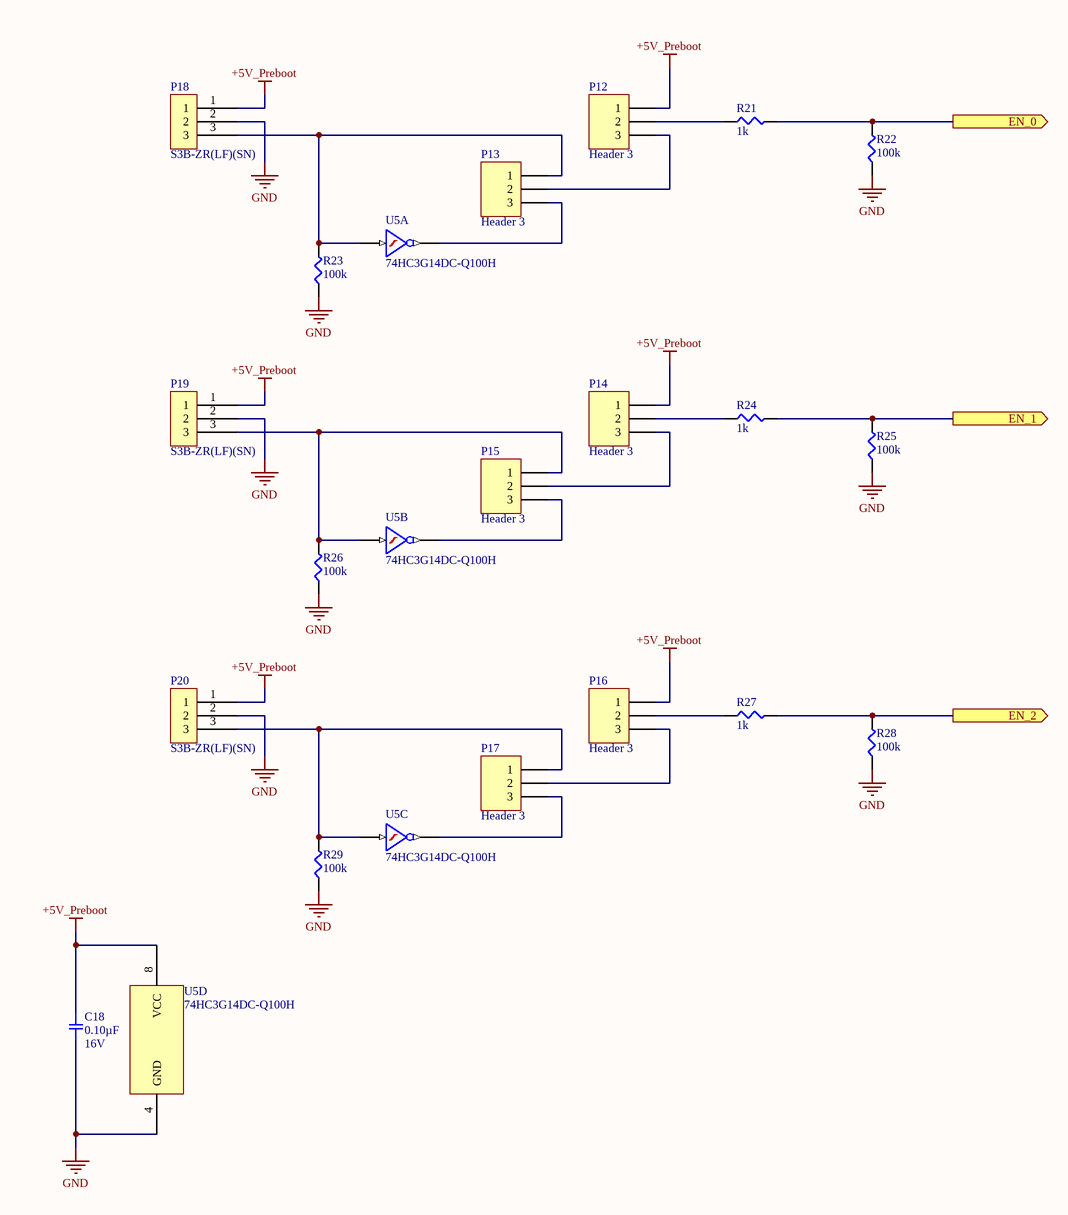
[diagram p3: Sheet4.SchDoc]

### Parts
C18  0.10µF  Voltage: 16V  [SMD-0402C]
P12  Header 3  [HDR1X3]  (no BOM)
P13  Header 3  [HDR1X3]  (no BOM)
P14  Header 3  [HDR1X3]  (no BOM)
P15  Header 3  [HDR1X3]  (no BOM)
P16  Header 3  [HDR1X3]  (no BOM)
P17  Header 3  [HDR1X3]  (no BOM)
P18  S3B-ZR(LF)(SN)  [S3B-ZR(LF)(SN)]
P19  S3B-ZR(LF)(SN)  [S3B-ZR(LF)(SN)]
P20  S3B-ZR(LF)(SN)  [S3B-ZR(LF)(SN)]
R21  1k  [SMD-0402-RES]
R22  100k  [SMD-0402-RES]
R23  100k  [SMD-0402-RES]
R24  1k  [SMD-0402-RES]
R25  100k  [SMD-0402-RES]
R26  100k  [SMD-0402-RES]
R27  1k  [SMD-0402-RES]
R28  100k  [SMD-0402-RES]
R29  100k  [SMD-0402-RES]
U5  74HC3G14DC-Q100H  [TSSOP50P310X100-8N (74HC3G14DC-Q100H)]  (parts A,B,C,D of 4)

### Ports
EN_0 (out), EN_1 (out), EN_2 (out)

### Nets
+5V_Preboot: C18.1 P12.1 P14.1 P16.1 P18.1 P19.1 P20.1 U5.8(VCC)
GND: C18.2 P18.2 P19.2 P20.2 R22.1 R23.1 R25.1 R26.1 R28.1 R29.1 U5.4(GND)
EN_0: R21.2 R22.2 ; port EN_0
EN_1: R24.2 R25.2 ; port EN_1
EN_2: R27.2 R28.2 ; port EN_2
NetP12_2: P12.2 R21.1
NetP12_3: P12.3 P13.2
NetP13_1: P13.1 P18.3 R23.2 U5.1(1A)
NetP13_3: P13.3 U5.7(1Y)
NetP14_2: P14.2 R24.1
NetP14_3: P14.3 P15.2
NetP15_1: P15.1 P19.3 R26.2 U5.3(2A)
NetP15_3: P15.3 U5.5(2Y)
NetP16_2: P16.2 R27.1
NetP16_3: P16.3 P17.2
NetP17_1: P17.1 P20.3 R29.2 U5.6(3A)
NetP17_3: P17.3 U5.2(3Y)

### Notes on the sheet
- Let's Build Rocket's Inc. Modular Paylaod System Based on TMP-010 Rev
  For more information visit https://github.com/LetsBuildRockets/Modular-Payload-System
  This work is licensed under CC BY-NC 4.0. To view a copy of this license, visit https://creativecommons.org/licenses/by-nc/4.0
- Title
- Size:
- Date:
- Assembly Variant:
- B
- Number:
- Time:
- Revision:
- Sheet
- of
- Author:
- File:

### Library data of the parts
C18 = GCM155R71C104KA55D: as C11 on sheet Sheet2; Datasheets: http://www.murata.com/~/media/webrenewal/support/library/catalog/products/capacitor/mlcc/c03e.ashx; Image: //media.digikey.com/Renders/Murata%20Renders/ZRB-SERIES-0402.jpg; Digi-Key Part Number: 490-4759-1-ND; Part Number: GCM155R71C104KA55D; Quantity Available: 734194; @ qty: 0; Packaging: Cut Tape (CT); Series: GCM; Part Status: Active; Value: 0.10µF; Temperature Coefficient: X7R; Operating Temperature: -55°C ~ 125°C; Features: -; Ratings: AEC-Q200; Applications: Automotive; Mounting Type: Surface Mount, MLCC; Package / Case: 0402 (1005 Metric); Size / Dimension: 0.039" L x 0.020" W (1.00mm x 0.50mm); Height - Seated (Max): -; Thickness (Max): 0.022" (0.55mm); Lead Spacing: -; Lead Style: -
P12-P17 = Header 3: Header, 3-Pin; LatestRevisionDate: 17-Jul-2002; LatestRevisionNote: Re-released for DXP Platform.; Publisher: Altium Limited
P18-P20 = S3B-ZR(LF)(SN): Unit Price (USD): 0.20
R21 R24 R27 = ERJ-2GEJ102X: as R2 on sheet Sheet3; Part Number: ERJ-2GEJ102X; Datasheets: http://industrial.panasonic.com/www-cgi/jvcr13pz.cgi?E+PZ+3+AOA0001+ERJ2GEJ102X+7+WW; Image: //media.digikey.com/Photos/Panasonic%20Photos/ERJ-PA2-Series.jpg; Digi-Key Part Number: P1.0KJCT-ND; Quantity Available: 1939857; Packaging: Cut Tape (CT); Series: ERJ; Part Status: Active; Value: 1k; Tolerance: ±5%; Composition: Thick Film; Features: Automotive AEC-Q200; Operating Temperature: -55°C ~ 155°C; Package / Case: 0402 (1005 Metric); Supplier Device Package: 0402; Size / Dimension: 0.039" L x 0.020" W (1.00mm x 0.50mm); Height - Seated (Max): 0.016" (0.40mm); Number of Terminations: 2; Failure Rate: -
R22 R23 R25 R26 R28 R29 = ERJ-2GEJ104X: as R9 on sheet Sheet2; Part Number: ERJ-2GEJ104X; Datasheets: http://industrial.panasonic.com/www-cgi/jvcr13pz.cgi?E+PZ+3+AOA0001+ERJ2GEJ104X+7+WW; Image: //media.digikey.com/Photos/Panasonic%20Photos/ERJ-PA2-Series.jpg; Digi-Key Part Number: P100KJCT-ND; Quantity Available: 2387986; Packaging: Cut Tape (CT); Series: ERJ; Part Status: Active; Value: 100k; Tolerance: ±5%; Composition: Thick Film; Features: Automotive AEC-Q200; Operating Temperature: -55°C ~ 155°C; Package / Case: 0402 (1005 Metric); Supplier Device Package: 0402; Size / Dimension: 0.039" L x 0.020" W (1.00mm x 0.50mm); Height - Seated (Max): 0.016" (0.40mm); Number of Terminations: 2; Failure Rate: -
U5 = 74HC3G14DC-Q100H: Unit Price (USD): 0.66

## Nets that join several sheets
+3.3V: Sheet1 (P3.1 P4.1), Sheet2 (9 pins), Sheet3 (15 pins)
+5V: Sheet1 (19 pins), Sheet2 (12 pins)
+5V_Bootstrap: Sheet1 (J1.44 P1.44 P23.44), Sheet2 (D2.K)
+5V_Preboot: Sheet1 (J1.25 P1.25 P23.25), Sheet2 (D1.K), Sheet4 (8 pins)
GND: Sheet1 (89 pins), Sheet2 (18 pins), Sheet3 (15 pins), Sheet4 (11 pins)
CAN0_N: Sheet1 (J1.4 P1.4), Sheet2 (P8.2 R13.1 R14.1 U3.6)
CAN0_P: Sheet1 (J1.6 P1.6), Sheet2 (P8.1 R1.2 R10.2 U3.7)
CAN0_RX: Sheet2 (U3.4), Sheet3 (P24.34 U1.38)
CAN0_STBY: Sheet2 (U3.8), Sheet3 (P24.26 U1.41)
CAN0_TX: Sheet2 (U3.1), Sheet3 (P24.33 U1.37)
CAN1_N: Sheet1 (J1.10 P1.10), Sheet2 (P10.2 R19.1 R20.1 U4.6)
CAN1_P: Sheet1 (J1.12 P1.12), Sheet2 (P10.1 R15.2 R16.2 U4.7)
CAN1_RX: Sheet2 (U4.4), Sheet3 (P24.32 U1.20)
CAN1_STBY: Sheet2 (U4.8), Sheet3 (P24.25 U1.39)
CAN1_TX: Sheet2 (U4.1), Sheet3 (P24.31 U1.19)
CTRL_SYNC: Sheet1 (J1.26 P1.26 P23.26), Sheet3 (U1.1)
DEBUG_RX: Sheet1 (P4.4), Sheet3 (U1.26)
DEBUG_TX: Sheet1 (P4.3), Sheet3 (U1.25)
DETECT_A: Sheet1 (J1.32 P23.32), Sheet2 (R33.2), Sheet3 (U1.21)
DETECT_B: Sheet1 (P1.32), Sheet2 (R31.2), Sheet3 (U1.22)
EN_0: Sheet1 (J1.34 P1.34 P23.34), Sheet4 (R21.2 R22.2)
EN_1: Sheet1 (J1.36 P1.36 P23.36), Sheet4 (R24.2 R25.2)
EN_2: Sheet1 (J1.38 P1.38 P23.38), Sheet4 (R27.2 R28.2)
P_GOOD: Sheet1 (J1.30 P1.30 P23.30), Sheet2 (D4.K P7.1 R30.2)
RESET: Sheet1 (P3.10), Sheet3 (R5.1 U1.40)
SWCLK: Sheet1 (P3.4), Sheet3 (R2.1 U1.45)
SWDIO: Sheet1 (P3.2), Sheet3 (U1.46)

## Assembly variants
DBG-011: not fitted P1 P2 R33
DBG-012: not fitted R33
DBG-013: not fitted C3 C4 C5 C6 C7 C8 C9 C10 C13 C14 C16 C17 P1 P2 P3 P4 P8 P9 P10 P11 P24 R2 R3 R4 R5 R10 R14 R16 R20 R31 U1 U3 U4 X1
DBG-014: not fitted C1 C2 C3 C4 C5 C6 C7 C8 C9 C10 C11 C12 C13 C14 C15 C16 C17 C18 D1 D2 D3 D4 P3 P4 P5 P5 P6 P6 P7 P8 P9 P10 P11 P12 P13 P14 P15 P16 P17 P18 P19 P20 P21 P21 P22 P22 P23 P24 R1 R2 R3 R4 R5 R6 R7 R8 R9 R10 R11 R12 R13 R14 R15 R16 R17 R18 R19 R20 R21 R22 R23 R24 R25 R26 R27 R28 R29 R30 R32 U1 U2 U3 U4 U5 X1